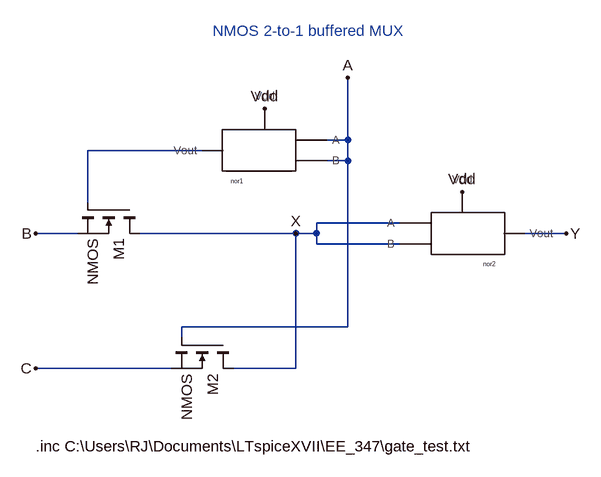
[diagram p0: schematic nmos_2t1_buf_mux.asc]
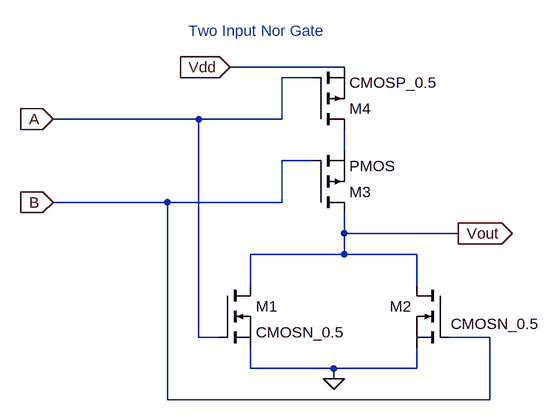
[diagram p1: sub-circuit my_nor.asc]
nmos_2t1_buf_mux.asc, the LTspice schematic file:
Version 4
SHEET 1 880 680
WIRE 320 80 320 -16
WIRE 320 80 288 80
WIRE 96 96 -80 96
WIRE 320 112 320 80
WIRE 320 112 288 112
WIRE -80 176 -80 96
WIRE 400 208 272 208
WIRE -96 224 -160 224
WIRE 240 224 0 224
WIRE 272 224 272 208
WIRE 272 224 240 224
WIRE 656 224 592 224
WIRE 272 240 272 224
WIRE 400 240 272 240
WIRE 320 368 320 112
WIRE 320 368 64 368
WIRE 64 384 64 368
WIRE 48 432 -160 432
WIRE 240 432 240 224
WIRE 240 432 144 432
FLAG 320 -16 A
FLAG -160 224 B
FLAG -160 432 C
FLAG 192 32 Vdd
FLAG 496 160 Vdd
FLAG 656 224 Y
FLAG 240 224 X
SYMBOL my_nor 192 96 M0
SYMATTR InstName nor1
SYMBOL my_nor 496 224 R0
SYMATTR InstName nor2
SYMBOL nmos 0 176 R90
SYMATTR InstName M1
SYMBOL nmos 144 384 R90
SYMATTR InstName M2
TEXT -160 552 Left 2 !.inc C:\\Users\\RJ\\Documents\\LTspiceXVII\\EE_347\\gate_test.txt
TEXT 112 -88 Left 2 ;NMOS 2-to-1 buffered MUX

my_nor.asc, the sub-circuit schematic file:
Version 4
SHEET 1 880 680
WIRE 336 -240 160 -240
WIRE 288 -224 240 -224
WIRE 112 -160 -112 -160
WIRE 240 -160 240 -224
WIRE 240 -160 112 -160
WIRE 336 -112 336 -144
WIRE 288 -96 240 -96
WIRE 64 -32 -112 -32
WIRE 240 -32 240 -96
WIRE 240 -32 64 -32
WIRE 336 16 336 -16
WIRE 512 16 336 16
WIRE 336 48 336 16
WIRE 336 48 192 48
WIRE 448 48 336 48
WIRE 192 96 192 48
WIRE 448 96 448 48
WIRE 112 176 112 -160
WIRE 144 176 112 176
WIRE 560 176 496 176
WIRE 192 224 192 192
WIRE 320 224 192 224
WIRE 448 224 448 192
WIRE 448 224 320 224
WIRE 320 240 320 224
WIRE 64 272 64 -32
WIRE 560 272 560 176
WIRE 560 272 64 272
FLAG -112 -32 B
IOPIN -112 -32 In
FLAG -112 -160 A
IOPIN -112 -160 In
FLAG 160 -240 Vdd
IOPIN 160 -240 In
FLAG 512 16 Vout
IOPIN 512 16 Out
FLAG 320 240 0
SYMBOL nmos 144 96 R0
SYMATTR InstName M1
SYMATTR Value CMOSN_0.5
SYMBOL nmos 496 96 M0
WINDOW 3 -141 59 Left 2
SYMATTR Value CMOSN_0.5
SYMATTR InstName M2
SYMBOL pmos 288 -144 M180
SYMATTR InstName M4
SYMATTR Value CMOSP_0.5
SYMBOL pmos 288 -16 M180
SYMATTR InstName M3
TEXT 96 -296 Left 2 ;Two Input Nor Gate

The netlist it stands for:
* nmos_2t1_buf_mux.asc
Xnor1 A A N001 Vdd my_nor
Xnor2 X X Y Vdd my_nor
M1 X N001 B B NMOS
M2 X A C C NMOS

* block symbol definitions
.subckt my_nor A B Vout Vdd
M1 Vout A 0 0 CMOSN_0.5
M2 Vout B 0 0 CMOSN_0.5
M4 N001 A Vdd Vdd CMOSP_0.5
M3 Vout B N001 N001 PMOS
* Two Input Nor Gate
.ends my_nor

.model NMOS NMOS
.model PMOS PMOS
.lib standard.mos
.inc C:\Users\RJ\Documents\LTspiceXVII\EE_347\gate_test.txt
* NMOS 2-to-1 buffered MUX
.backanno
.end